# Altium schematic sheet МПСУ.464421.22-01 RF Interface.SchDoc
size 420 x 297 mm; ApprovedBy: Орешкин; Author: Лазба; DrawnBy: Лазба; Engineer: Лазба; Organization: МИЭТ; Address1: Address1; Address2: Address2; Address3: Address3; Address4: Address4; SheetNumber: 2; SheetTotal: 6; DocumentName2SCH: Схема электрическая; DocumentName3SCH: принципиальная; UtverjdenNumberSCH: МПСУ.464421.221; UtverjdenSCH: Утвержден; DocumentTypeSCH: Э3; NachOtdelaSCH: Орешкин
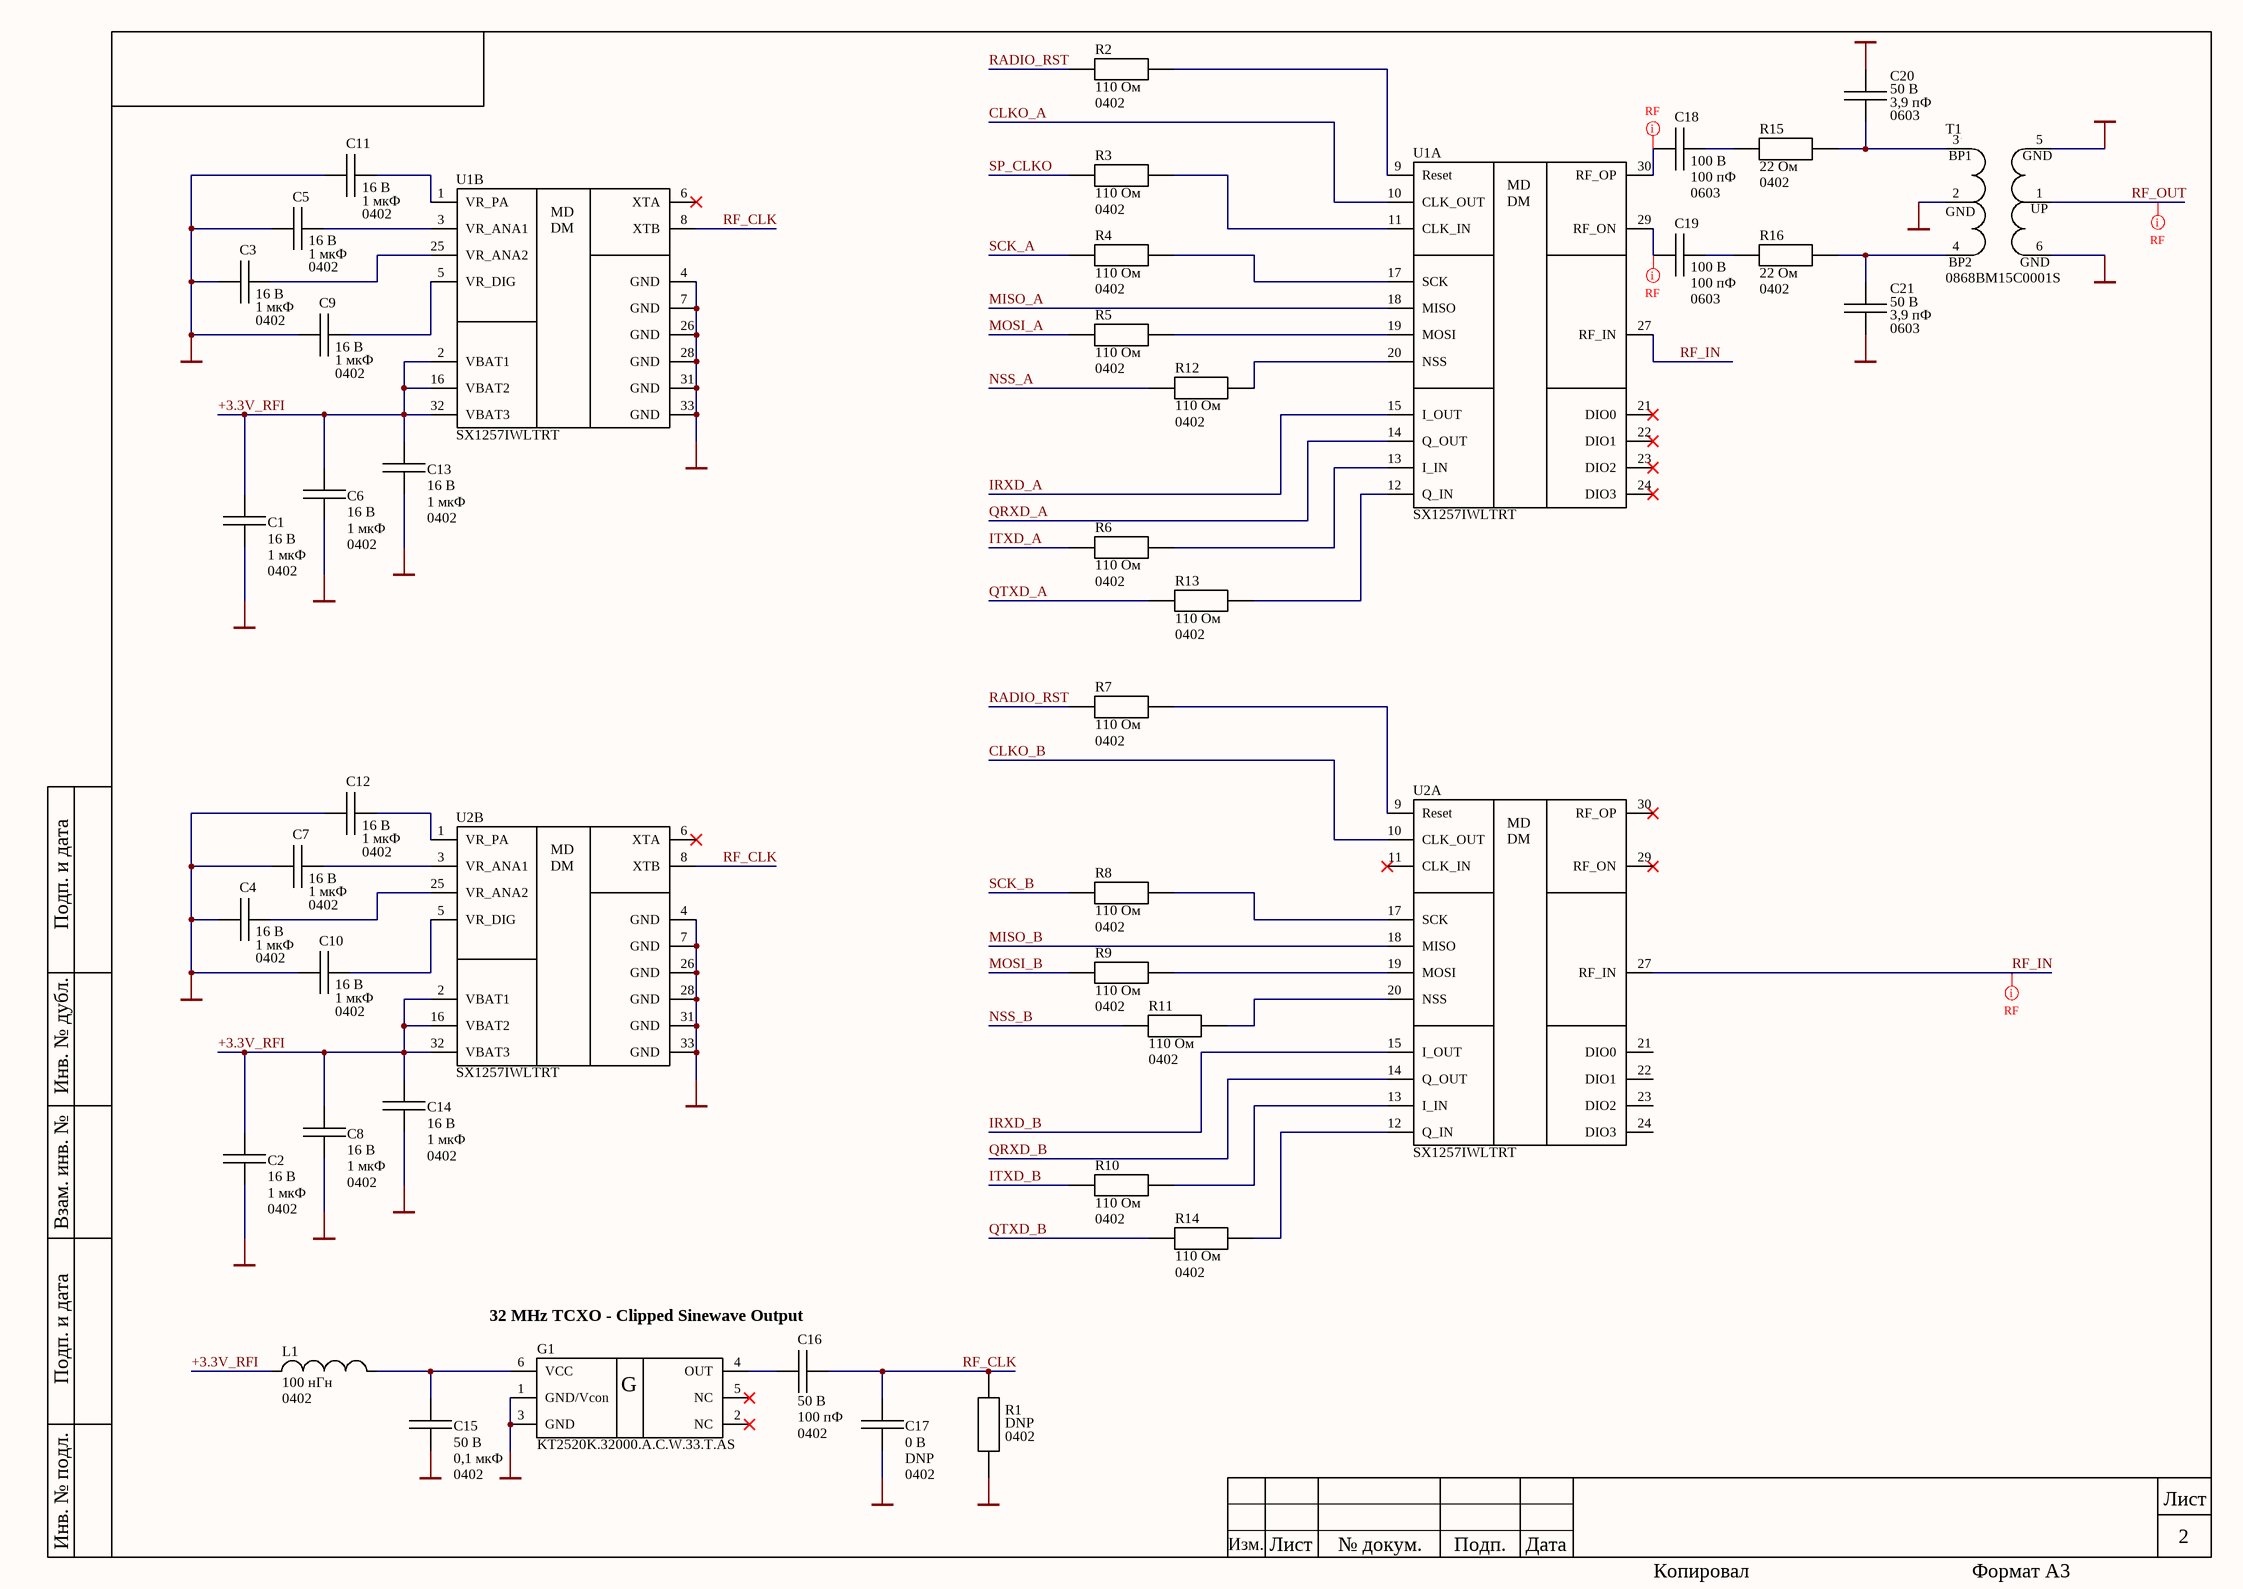
[diagram p0: МПСУ.464421.22-01 RF Interface.SchDoc]

## Parts
C1  value 1 мкФ  Peak_Condition: 16 В  Package: 0402  [CAPC100X50X55L20N]  (hidden comment: 1 мкФ ± 10 % 16 В X5R 0402 GRM155R61C105KA12D)
C2  value 1 мкФ  Peak_Condition: 16 В  Package: 0402  [CAPC100X50X55L20N]  (hidden comment: 1 мкФ ± 10 % 16 В X5R 0402 GRM155R61C105KA12D)
C3  value 1 мкФ  Peak_Condition: 16 В  Package: 0402  [CAPC100X50X55L20N]  (hidden comment: 1 мкФ ± 10 % 16 В X5R 0402 GRM155R61C105KA12D)
C4  value 1 мкФ  Peak_Condition: 16 В  Package: 0402  [CAPC100X50X55L20N]  (hidden comment: 1 мкФ ± 10 % 16 В X5R 0402 GRM155R61C105KA12D)
C5  value 1 мкФ  Peak_Condition: 16 В  Package: 0402  [CAPC100X50X55L20N]  (hidden comment: 1 мкФ ± 10 % 16 В X5R 0402 GRM155R61C105KA12D)
C6  value 1 мкФ  Peak_Condition: 16 В  Package: 0402  [CAPC100X50X55L20N]  (hidden comment: 1 мкФ ± 10 % 16 В X5R 0402 GRM155R61C105KA12D)
C7  value 1 мкФ  Peak_Condition: 16 В  Package: 0402  [CAPC100X50X55L20N]  (hidden comment: 1 мкФ ± 10 % 16 В X5R 0402 GRM155R61C105KA12D)
C8  value 1 мкФ  Peak_Condition: 16 В  Package: 0402  [CAPC100X50X55L20N]  (hidden comment: 1 мкФ ± 10 % 16 В X5R 0402 GRM155R61C105KA12D)
C9  value 1 мкФ  Peak_Condition: 16 В  Package: 0402  [CAPC100X50X55L20N]  (hidden comment: 1 мкФ ± 10 % 16 В X5R 0402 GRM155R61C105KA12D)
C10  value 1 мкФ  Peak_Condition: 16 В  Package: 0402  [CAPC100X50X55L20N]  (hidden comment: 1 мкФ ± 10 % 16 В X5R 0402 GRM155R61C105KA12D)
C11  value 1 мкФ  Peak_Condition: 16 В  Package: 0402  [CAPC100X50X55L20N]  (hidden comment: 1 мкФ ± 10 % 16 В X5R 0402 GRM155R61C105KA12D)
C12  value 1 мкФ  Peak_Condition: 16 В  Package: 0402  [CAPC100X50X55L20N]  (hidden comment: 1 мкФ ± 10 % 16 В X5R 0402 GRM155R61C105KA12D)
C13  value 1 мкФ  Peak_Condition: 16 В  Package: 0402  [CAPC100X50X55L20N]  (hidden comment: 1 мкФ ± 10 % 16 В X5R 0402 GRM155R61C105KA12D)
C14  value 1 мкФ  Peak_Condition: 16 В  Package: 0402  [CAPC100X50X55L20N]  (hidden comment: 1 мкФ ± 10 % 16 В X5R 0402 GRM155R61C105KA12D)
C15  value 0,1 мкФ  Peak_Condition: 50 В  Package: 0402  [CAPC100X50X55L20N]  (hidden comment: 0,1 мкФ ± 10 % 50 В X7R 0402 GRM155R71H104KE14J)
C16  value 100 пФ  Peak_Condition: 50 В  Package: 0402  [CAPC100X50X55L20N]  (hidden comment: 100 пФ ± 5 % 50 В C0G 0402 GRM1555C1H101JZ01D)
C17  value DNP  Peak_Condition: 0 В  Package: 0402  [CAPC100X50X55L20N]  (hidden comment: DNP 0402)
C18  value 100 пФ  Peak_Condition: 100 В  Package: 0603  [CAPC160X80X90L30N]  (hidden comment: 100 пФ ± 1 % 100 В C0G 0603 GRM1885C2A101FA01D)
C19  value 100 пФ  Peak_Condition: 100 В  Package: 0603  [CAPC160X80X90L30N]  (hidden comment: 100 пФ ± 1 % 100 В C0G 0603 GRM1885C2A101FA01D)
C20  value 3,9 пФ  Peak_Condition: 50 В  Package: 0603  [CAPC160X80X90L30N]  (hidden comment: 3,9 пФ ± 0,25 пФ 50 В C0G 0603 GRM1885C1H3R9CZ01D)
C21  value 3,9 пФ  Peak_Condition: 50 В  Package: 0603  [CAPC160X80X90L30N]  (hidden comment: 3,9 пФ ± 0,25 пФ 50 В C0G 0603 GRM1885C1H3R9CZ01D)
G1  KT2520K.32000.A.C.W.33.T.AS  [KT2520K]
L1  value 100 нГн  Package: 0402  [INDC100X50X60L10N]  (hidden comment: 100 нГн ± 5 % 200 мА 0402 LQG15HNR10J02D)
R1  value DNP  Package: 0402  [RESC100X50X40L25N]  (hidden comment: DNP 0402)
R2  value 110 Ом  Package: 0402  [RESC100X50X40L25N]  (hidden comment: 110 Ом ± 5 % 0 Вт 0402 RC-02U111JT)
R3  value 110 Ом  Package: 0402  [RESC100X50X40L25N]  (hidden comment: 110 Ом ± 5 % 0 Вт 0402 RC-02U111JT)
R4  value 110 Ом  Package: 0402  [RESC100X50X40L25N]  (hidden comment: 110 Ом ± 5 % 0 Вт 0402 RC-02U111JT)
R5  value 110 Ом  Package: 0402  [RESC100X50X40L25N]  (hidden comment: 110 Ом ± 5 % 0 Вт 0402 RC-02U111JT)
R6  value 110 Ом  Package: 0402  [RESC100X50X40L25N]  (hidden comment: 110 Ом ± 5 % 0 Вт 0402 RC-02U111JT)
R7  value 110 Ом  Package: 0402  [RESC100X50X40L25N]  (hidden comment: 110 Ом ± 5 % 0 Вт 0402 RC-02U111JT)
R8  value 110 Ом  Package: 0402  [RESC100X50X40L25N]  (hidden comment: 110 Ом ± 5 % 0 Вт 0402 RC-02U111JT)
R9  value 110 Ом  Package: 0402  [RESC100X50X40L25N]  (hidden comment: 110 Ом ± 5 % 0 Вт 0402 RC-02U111JT)
R10  value 110 Ом  Package: 0402  [RESC100X50X40L25N]  (hidden comment: 110 Ом ± 5 % 0 Вт 0402 RC-02U111JT)
R11  value 110 Ом  Package: 0402  [RESC100X50X40L25N]  (hidden comment: 110 Ом ± 5 % 0 Вт 0402 RC-02U111JT)
R12  value 110 Ом  Package: 0402  [RESC100X50X40L25N]  (hidden comment: 110 Ом ± 5 % 0 Вт 0402 RC-02U111JT)
R13  value 110 Ом  Package: 0402  [RESC100X50X40L25N]  (hidden comment: 110 Ом ± 5 % 0 Вт 0402 RC-02U111JT)
R14  value 110 Ом  Package: 0402  [RESC100X50X40L25N]  (hidden comment: 110 Ом ± 5 % 0 Вт 0402 RC-02U111JT)
R15  value 22 Ом  Package: 0402  [RESC100X50X40L25N]  (hidden comment: 22 Ом ± 1 % 0 Вт 0402 RC0402FR-0722RL)
R16  value 22 Ом  Package: 0402  [RESC100X50X40L25N]  (hidden comment: 22 Ом ± 1 % 0 Вт 0402 RC0402FR-0722RL)
T1  0868BM15C0001S  [LCC065P125X200X085-6]
U1  SX1257IWLTRT  [SX1257IWLTRT]  (parts A,B of 2)
U2  SX1257IWLTRT  [SX1257IWLTRT]  (parts A,B of 2)

## Nets
GND: C1.1 C2.1 C3.2 C4.2 C5.2 C6.1 C7.2 C8.1 C9.2 C10.2 C11.2 C12.2 C13.1 C14.1 C15.2 C17.2 C20.1 C21.2 G1.1(GND/Vcon) G1.3(GND) R1.2 T1.2(GND) T1.5(GND) T1.6(GND) U1.4(GND) U1.7(GND) U1.26(GND) U1.28(GND) U1.31(GND) U1.33(GND) U2.4(GND) U2.7(GND) U2.26(GND) U2.28(GND) U2.31(GND) U2.33(GND)
+3.3V_RFI: C1.2 C2.2 C6.2 C8.2 C13.2 C14.2 L1.1 U1.2(VBAT1) U1.16(VBAT2) U1.32(VBAT3) U2.2(VBAT1) U2.16(VBAT2) U2.32(VBAT3)
CLKO_A: U1.10(CLK_OUT)
CLKO_B: U2.10(CLK_OUT)
IRXD_A: U1.15(I_OUT)
IRXD_B: U2.15(I_OUT)
ITXD_A: R6.1
ITXD_B: R10.1
MISO_A: U1.18(MISO)
MISO_B: U2.18(MISO)
MOSI_A: R5.1
MOSI_B: R9.1
NSS_A: R12.1
NSS_B: R11.1
QRXD_A: U1.14(Q_OUT)
QRXD_B: U2.14(Q_OUT)
QTXD_A: R13.1
QTXD_B: R14.1
RADIO_RST: R2.1 R7.1
RF_CLK: C16.2 C17.1 R1.1 U1.8(XTB) U2.8(XTB)
RF_IN: U1.27(RF_IN) U2.27(RF_IN)
RF_OUT: T1.1(UP)
SCK_A: R4.1
SCK_B: R8.1
SP_CLKO: R3.1
NetC3_1: C3.1 U1.25(VR_ANA2)
NetC4_1: C4.1 U2.25(VR_ANA2)
NetC5_1: C5.1 U1.3(VR_ANA1)
NetC7_1: C7.1 U2.3(VR_ANA1)
NetC9_1: C9.1 U1.5(VR_DIG)
NetC10_1: C10.1 U2.5(VR_DIG)
NetC11_1: C11.1 U1.1(VR_PA)
NetC12_1: C12.1 U2.1(VR_PA)
NetC15_1: C15.1 G1.6(VCC) L1.2
NetC16_1: C16.1 G1.4(OUT)
NetC18_1: C18.1 U1.30(RF_OP)
NetC18_2: C18.2 R15.1
NetC19_1: C19.1 U1.29(RF_ON)
NetC19_2: C19.2 R16.1
NetC20_2: C20.2 R15.2 T1.3(BP1)
NetC21_1: C21.1 R16.2 T1.4(BP2)
NetR2_2: R2.2 U1.9(Reset)
NetR3_2: R3.2 U1.11(CLK_IN)
NetR4_2: R4.2 U1.17(SCK)
NetR5_2: R5.2 U1.19(MOSI)
NetR6_2: R6.2 U1.13(I_IN)
NetR7_2: R7.2 U2.9(Reset)
NetR8_2: R8.2 U2.17(SCK)
NetR9_2: R9.2 U2.19(MOSI)
NetR10_2: R10.2 U2.13(I_IN)
NetR11_2: R11.2 U2.20(NSS)
NetR12_2: R12.2 U1.20(NSS)
NetR13_2: R13.2 U1.12(Q_IN)
NetR14_2: R14.2 U2.12(Q_IN)

Not connected (* = marked no-connect by the designer): G1 2(NC)* 5(NC)*; U1 6(XTA)* 21(DIO0)* 22(DIO1)* 23(DIO2)* 24(DIO3)*; U2 6(XTA)* 11(CLK_IN)* 21(DIO0) 22(DIO1) 23(DIO2) 24(DIO3) 29(RF_ON)* 30(RF_OP)*

## Layout directives
net class RF: NetC18_1, NetC19_1, RF_IN, RF_OUT

## Notes on the sheet
- 32 MHz TCXO - Clipped Sinewave Output
- Подп. и дата
- Инв. № дубл.
- Взам. инв. №
- Инв. № подл.
- Изм.
- Лист
- № докум.
- Подп.
- Дата
- Копировал
- Формат А3
- (in symbol KT2520K.*****.*.*.*.**.*.*) G
- (in symbol SX1257IWLTRT, part A) MD / DM
- (in symbol SX1257IWLTRT, part B) MD / DM

## Library data of the parts
C1-C15 = C 0402: Capacitor 0402; Manufacturer: Murata; Tolerance: 10 %; Designer: Свидерский; 3D_Body: +; Category: Passive; Subcategory: Capacitor; Status: Approved
  C1-C14: PartNumber: GRM155R61C105KA12D; Dielectric: X5R
  C15: PartNumber: GRM155R71H104KE14J; Dielectric: X7R
C16 = C 0402: Capacitor 0402; Manufacturer: Murata; Tolerance: 5 %; Designer: Свидерский; 3D_Body: +; PartNumber: GRM1555C1H101JZ01D; Category: Passive; Subcategory: Capacitor; Dielectric: C0G; Status: Approved
C17 = C 0402: Capacitor 0402; Tolerance: 0 %; Designer: Свидерский; Notes: CP; 3D_Body: +; Category: Passive; Subcategory: Capacitor; Status: Approved
C18 C19 = C 0603: Capacitor 0603; Manufacturer: Murata; Tolerance: 1 %; Designer: Свидерский; 3D_Body: +; PartNumber: GRM1885C2A101FA01D; Category: Passive; Subcategory: Capacitor; Dielectric: C0G; Status: Approved
C20 C21 = C 0603: Capacitor 0603; Manufacturer: Murata; Tolerance: 0,25 пФ; Designer: Свидерский; 3D_Body: +; PartNumber: GRM1885C1H3R9CZ01D; Category: Passive; Subcategory: Capacitor; Dielectric: C0G; Status: Approved
G1 = KT2520K.*****.*.*.*.**.*.*: Temperature Compensated Crystal Oscillators (TCXO, VCTCXO) Surface Mount Type; Manufacturer: Kyocera; Designer: Лазба; 3D_Body: +; Standard Freq, MHz: 19.2, 26, 32, 38.4, 48, 52; ComponentLink1Description: Техническое описание; ComponentLink1URL: Q:\Libs\Descriptions_PDF\kt2520_e.pdf; Category: IC; Subcategory: Crystal Oscillator; Status: Check; Package: Miniature SMD type (2.5×2.0×0.8mm); PartNumber: KT2520K.32000.A.C.W.33.T.AS
L1 = L 0402: Inductor 0402; Manufacturer: Murata; Designer: Свидерский; 3D_Body: +; Tolerance: 5 %; Peak_Condition: 200 мА; PartNumber: LQG15HNR10J02D; Category: Passive; Subcategory: Inductor; Status: Approved
R1 = R 0402: Resistor 0402; Designer: Свидерский; Notes: CP; 3D_Body: +; Tolerance: 0 %; Peak_Condition: 0 Вт; Category: Passive; Subcategory: Resistor; Status: Approved
R2-R14 = R 0402: Resistor 0402; Manufacturer: Fenghua; Designer: Свидерский; 3D_Body: +; Tolerance: 5 %; Peak_Condition: 0 Вт; PartNumber: RC-02U111JT; Category: Passive; Subcategory: Resistor; Status: Approved
R15 R16 = R 0402: Resistor 0402; Manufacturer: Thunder; Designer: Свидерский; 3D_Body: +; Tolerance: 1 %; Peak_Condition: 0 Вт; PartNumber: RC0402FR-0722RL; Category: Passive; Subcategory: Resistor; Status: Approved
T1 = 0868BM15C0001*: 868MHz Center Frequency Balun/Filter for high frequency ceramic solutions 10MHz Bandwidth 0.5dB 0805 (2012 Metric), 8 PC Pad; Manufacturer: Johanson Technology Inc.; Designer: Лазба; 3D_Body: +; ComponentLink1Description: Техническое описание; ComponentLink1URL: Q:\Libs\Descriptions_PDF\0868BM15C0001.pdf; Category: Passive; Subcategory: Filter; Status: Check; PartNumber: 0868BM15C0001S
U1 U2 = SX1257IWLTRT: LoRa Core™ Low Power Digital I and Q RF Multi-PHY Mode Analog Front End 860-1000MHz; Manufacturer: Semtech; Designer: Лазба; 3D_Body: +; ComponentLink1Description: Техническое описание; ComponentLink1URL: Q:\Libs\Descriptions_PDF\DS_SX1257_V1.2.pdf; Category: IC; Subcategory: Transciever; Status: Check; Package: QFN32; PartNumber: SX1257IWLTRT